# EAGLE design power_ver3 (EAGLE 9.6.2)
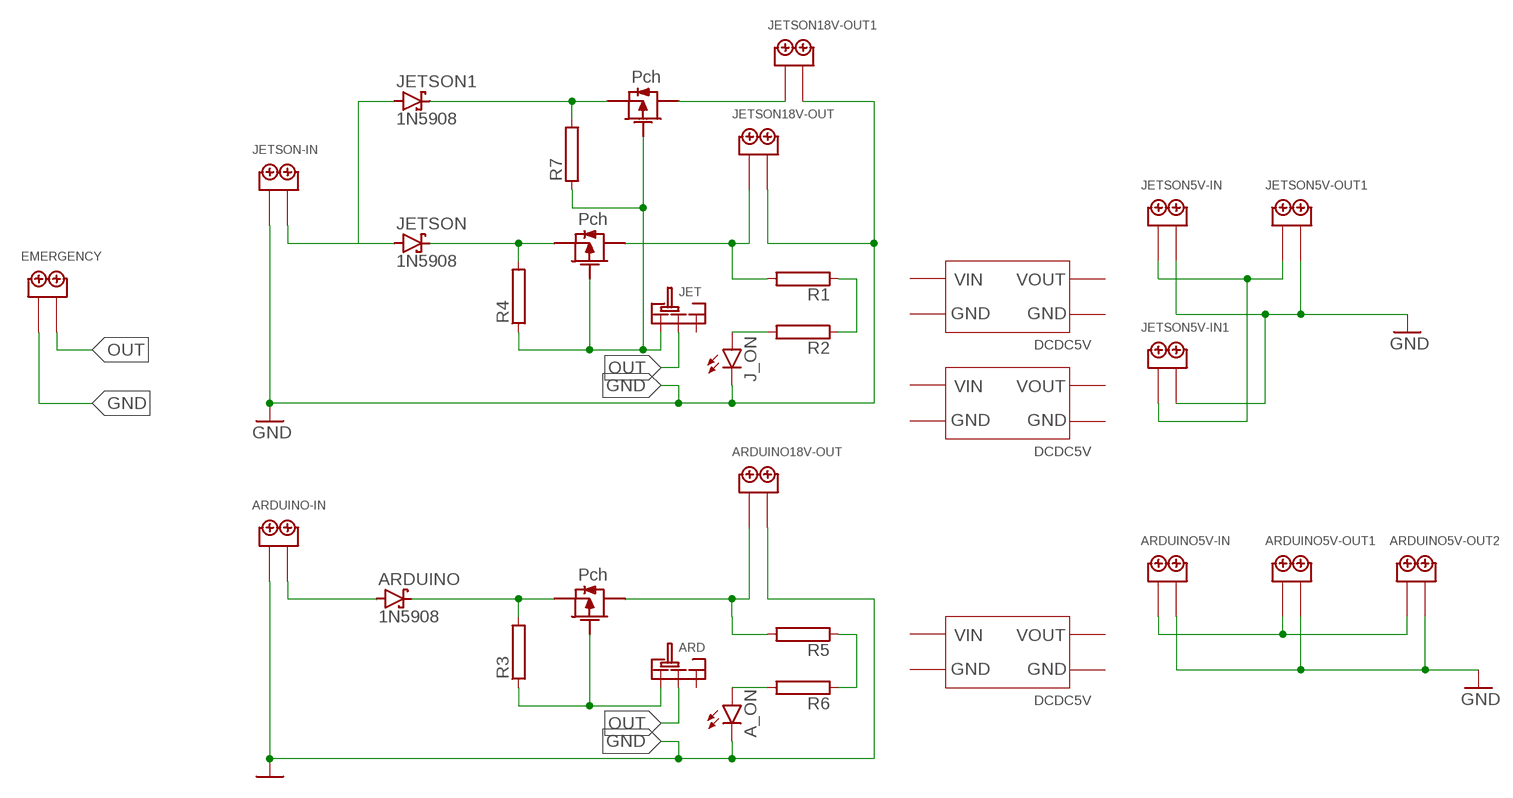
[diagram p0: schematic, sheet 1]

## Parts
A_ON  LED5MM  [LED5MM]
ARD  SRIDE_SWITCH  [SRIDE_SWITCH]
ARDUINO  1N5908  [C4111-15]
ARDUINO5V-IN  2PIN  [2PIN]
ARDUINO5V-OUT1  2PIN  [2PIN]
ARDUINO5V-OUT2  2PIN  [2PIN]
ARDUINO18V-OUT  2PIN  [2PIN]
ARDUINO-IN  2PIN  [2PIN]
EMERGENCY  2PIN  [2PIN]
J_ON  LED5MM  [LED5MM]
JET  SRIDE_SWITCH  [SRIDE_SWITCH]
JETSON  1N5908  [C4111-15]
JETSON1  1N5908  [C4111-15]
JETSON5V-IN  2PIN  [2PIN]
JETSON5V-IN1  2PIN  [2PIN]
JETSON5V-OUT1  2PIN  [2PIN]
JETSON18V-OUT  2PIN  [2PIN]
JETSON18V-OUT1  2PIN  [2PIN]
JETSON-IN  2PIN  [2PIN]
R1  RAC01  [AC01]
R2  RAC01  [AC01]
R3  RAC01  [AC01]
R4  RAC01  [AC01]
R5  RAC01  [AC01]
R6  RAC01  [AC01]
R7  RAC01  [AC01]
U$1  2SJ334  [2SJ334]
U$2  DCDCDEV  [DCDCDEV]
U$4  2SJ334  [2SJ334]
U$5  2SJ334  [2SJ334]
U$6  DCDCDEV  [DCDCDEV]
U$23  DCDCDEV  [DCDCDEV]

## Nets
18V [power]: JETSON1.A JETSON-IN.P$2 JETSON.A
GND: A_ON.K(C) ARDUINO5V-IN.P$2 ARDUINO5V-OUT1.P$2 ARDUINO5V-OUT2.P$2 ARDUINO18V-OUT.P$2 ARDUINO-IN.P$1 EMERGENCY.P$1 J_ON.K(C) JETSON5V-IN1.P$2 JETSON5V-IN.P$2 JETSON5V-OUT1.P$2 JETSON18V-OUT1.P$2 JETSON18V-OUT.P$2 JETSON-IN.P$1
MA [power]: JETSON.C R4.2 U$4.SOURCE
MA1 [power]: JETSON1.C R7.2 U$1.SOURCE
MAC [power]: JETSON18V-OUT.P$1 R1.2 U$4.DRAIN
MAD [jet]: JETSON5V-IN1.P$1 JETSON5V-IN.P$1 JETSON5V-OUT1.P$1
MBB [power]: ARDUINO-IN.P$2 ARDUINO.A
MKK [power]: ARDUINO.C R3.2 U$5.SOURCE
ML [power]: ARDUINO5V-IN.P$1 ARDUINO5V-OUT1.P$1 ARDUINO5V-OUT2.P$1
MOO [power]: ARDUINO18V-OUT.P$1 R5.2 U$5.DRAIN
N$1: ARD.L R3.1 U$5.GATE
N$2: J_ON.A R2.2
N$3: A_ON.A R6.2
N$4 [power]: JET.L R4.1 R7.1 U$1.GATE U$4.GATE
N$5 [power]: JETSON18V-OUT1.P$1 U$1.DRAIN
N$6: R5.1 R6.1
N$49: R1.1 R2.1
OUT: ARD.LR EMERGENCY.P$2 JET.LR
Unconnected: ARD.R JET.R

## Library data of the parts
A_ON J_ON = led:LED: LED OSRAM: - CHIPLED LG R971, LG N971, LY N971, LG Q971, LY Q971, LO R971, LY R971 LH N974, LH R974 LS Q976, LO Q976, LY Q976 LO Q996 - Hyper CHIPLED LW Q18S LB Q993, LB Q99A, LB R99A - SideLED LS A670, LO A670, LY A670, LG A670, LP A670 LB A673, LV A673, LT A673, LW A673 LH A674 LY A675 LS A676, LA A676, LO A676, LY A676, LW A676 LS A679, LY A679, LG A679 - Hyper Micro SIDELED® LS Y876, LA Y876, LO Y876, LY Y876 LT Y87S - SmartLED LW L88C, LW L88S LB L89C, LB L89S, LG L890 LS L89K, LO L89K, LY L89K LS L896, LA L896, LO L896, LY L896 - TOPLED LS T670, LO T670, LY T670, LG T670, LP T670 LSG T670, LSP T670, LSY T670, LOP T670, LYG T670 LG T671, LOG T671, LSG T671 LB T673, LV T673, LT T673, LW T673 LH T674 LS T676, LA T676, LO T676, LY T676, LB T676, LH T676, LSB T676, LW T676 LB T67C, LV T67C, LT T67C, LS T67K, LO T67K, LY T67K, LW E67C LS E67B, LA E67B, LO E67B, LY E67B, LB E67C, LV E67C, LT E67C LW T67C LS T679, LY T679, LG T679 LS T770, LO T770, LY T770, LG T770, LP T770 LB T773, LV T773, LT T773, LW T773 LH T774 LS E675, LA E675, LY E675, LS T675 LS T776, LA T776, LO T776, LY T776, LB T776 LHGB T686 LT T68C, LB T68C - Hyper Mini TOPLED® LB M676 - Mini TOPLED Santana® LG M470 LS M47K, LO M47K, LY M47K Source: http://www.osram.convergy.de LUXEON: - LUMILED® LXK2-PW12-R00, LXK2-PW12-S00, LXK2-PW14-U00, LXK2-PW14-V00 LXK2-PM12-R00, LXK2-PM12-S00, LXK2-PM14-U00 LXK2-PE12-Q00, LXK2-PE12-R00, LXK2-PE12-S00, LXK2-PE14-T00, LXK2-PE14-U00 LXK2-PB12-K00, LXK2-PB12-L00, LXK2-PB12-M00, LXK2-PB14-N00, LXK2-PB14-P00, LXK2-PB14-Q00 LXK2-PR12-L00, LXK2-PR12-M00, LXK2-PR14-Q00, LXK2-PR14-R00 LXK2-PD12-Q00, LXK2-PD12-R00, LXK2-PD12-S00 LXK2-PH12-R00, LXK2-PH12-S00 LXK2-PL12-P00, LXK2-PL12-Q00, LXK2-PL12-R00 Source: www.luxeon.com KINGBRIGHT: KA-3528ASYC Source: www.kingbright.com
ARD JET = Sride Switch:SRIDE_SWITCH
ARDUINO JETSON JETSON1 = diode:1N5908: DIODE schottky
ARDUINO5V-IN ARDUINO5V-OUT1 ARDUINO5V-OUT2 ARDUINO18V-OUT ARDUINO-IN EMERGENCY JETSON5V-IN JETSON5V-IN1 JETSON5V-OUT1 JETSON18V-OUT JETSON18V-OUT1 JETSON-IN = TB113-2B-x-x-0-x-x:2PIN
R1-R7 = resistor-power:R: Power Resitor; OC_FARNELL: unknown; OC_NEWARK: unknown
U$1 U$4 U$5 = 2SJ334:2SJ334
U$2 U$6 U$23 = dcdcDEVkit:DCDCDEV

## Net classes
0 default: width 1.016 mm
1 power: width 2.54 mm, clearance 0.127 mm
3 jet: width 3.81 mm, clearance 0.127 mm

## Board
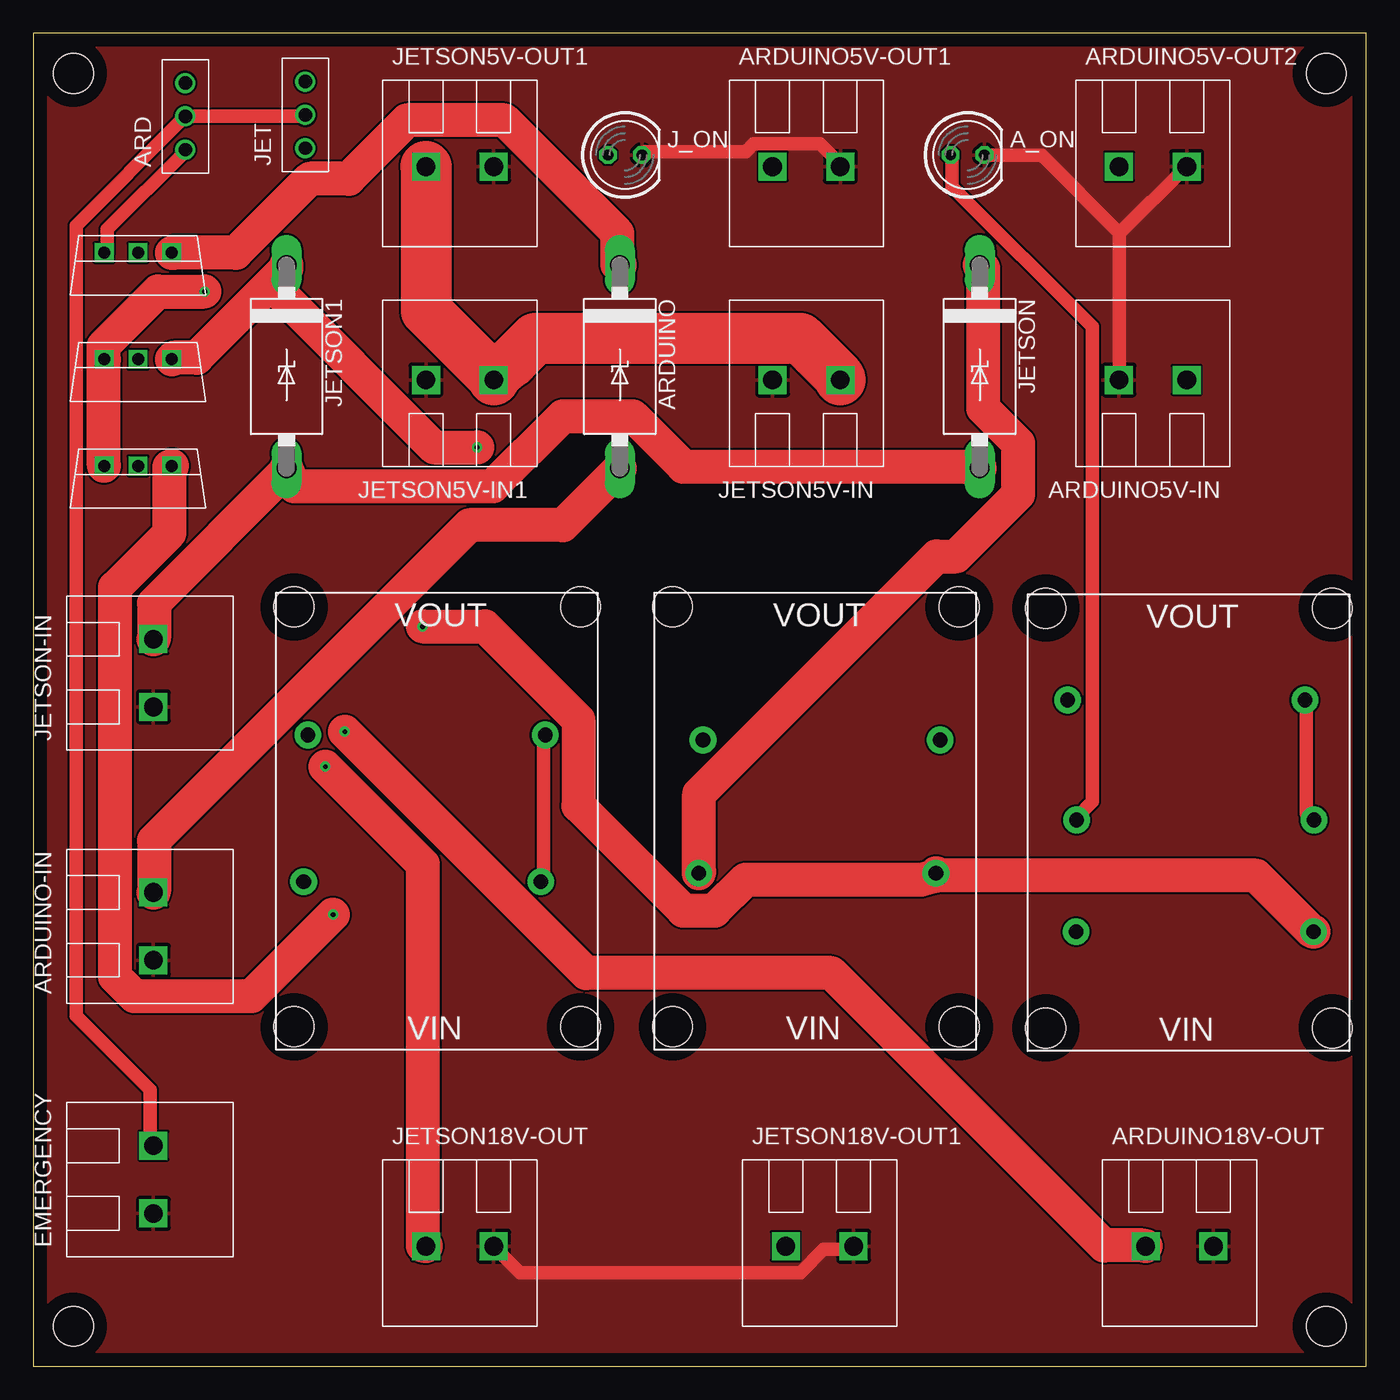
[diagram p1: board, top side]
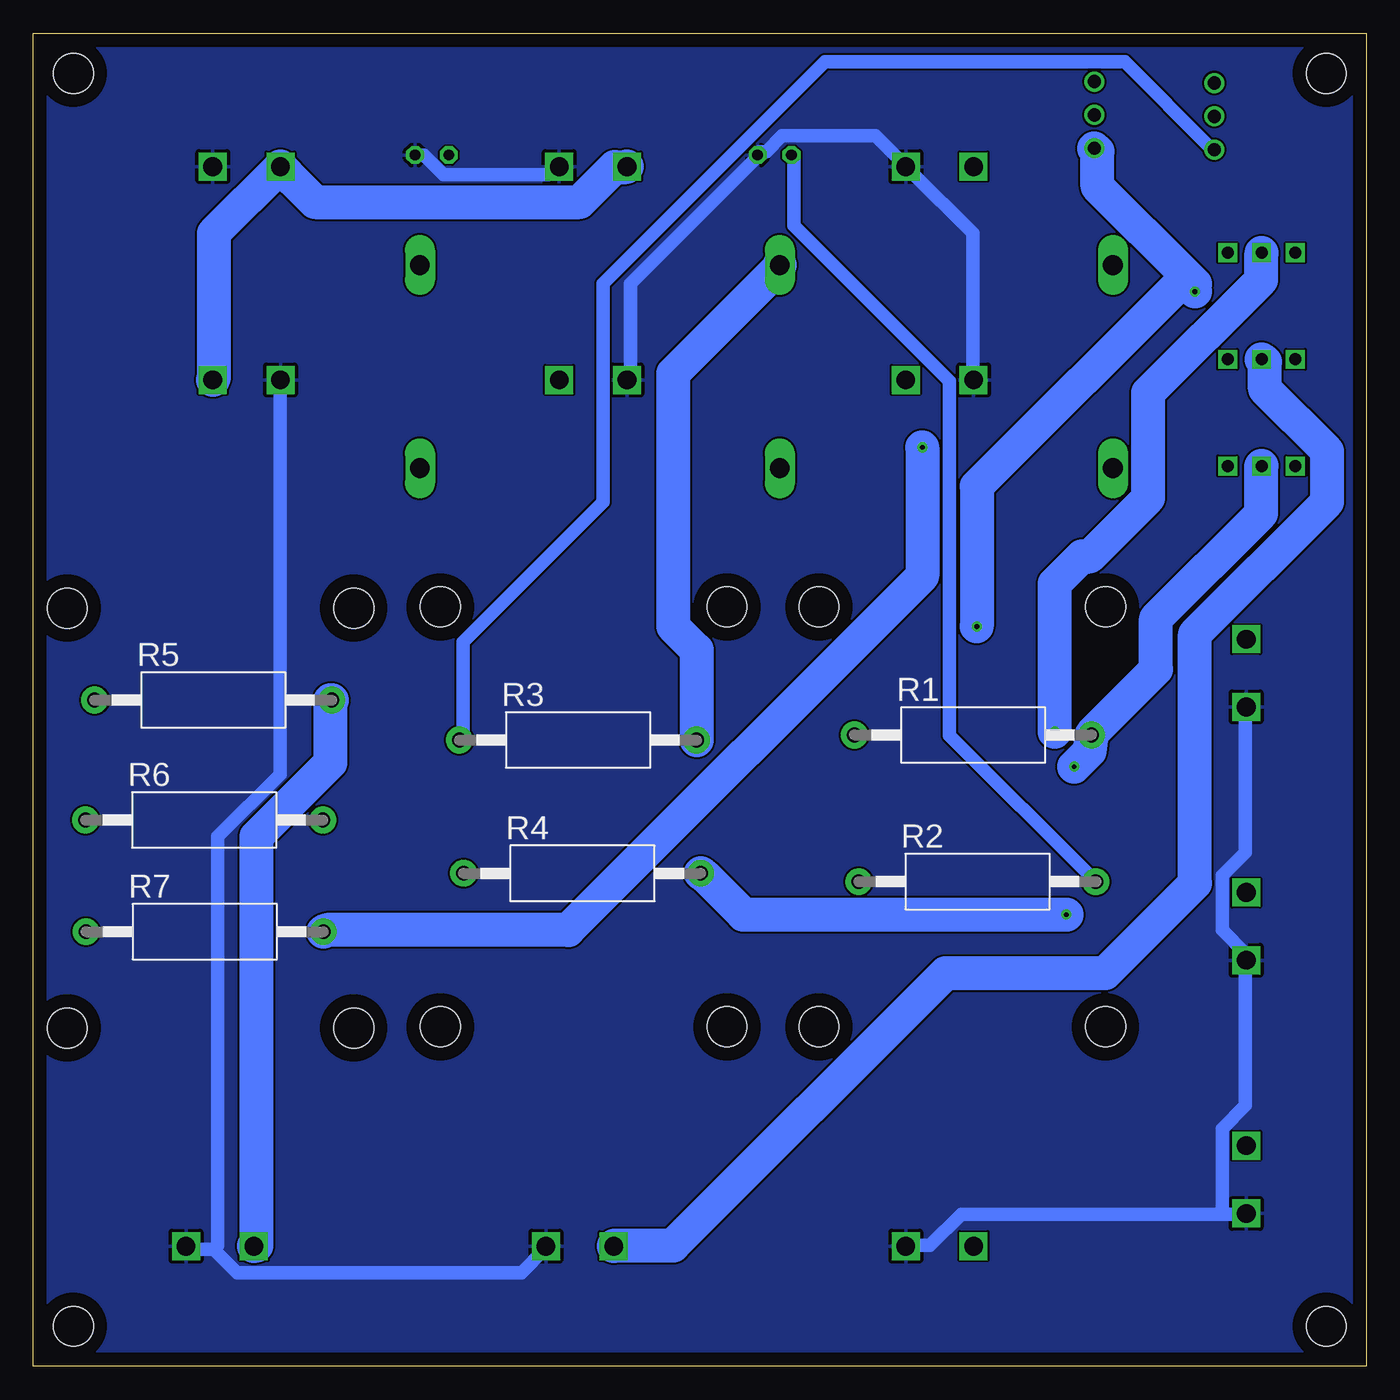
[diagram p2: board, bottom side, seen from below]

Size 100 x 100 mm. Coordinates in mm from the lower left corner, seen from the top.
Outline: 0,0 100,0 100,100 0,100 0,0
Copper layers (1*16): Top 0.035mm / dielectric 1.5mm / Bottom 0.035mm
Design rules "default": minimum track width 6mil, minimum drill 0.35mm, track to track 6mil, track to pad 6mil, pad to pad 6mil, via to via 6mil, smd to smd 6mil, copper to edge 40mil, drill to drill 6mil, minimum pad ring 10mil, minimum via ring 8mil, stop-mask expansion 4mil, vias tented up to drill 0mil, thermal gap 10mil
Holes 3 mm at 3,97 97,97 97,3 3,3

### Footprints (pad centres in the part's own frame; a part is rotated, then mirrored left to right if it is on the bottom)
LED5MM = drill 0.813 octagon: A -1.27,0; K 1.27,0
SRIDE_SWITCH = drill 1: L -2.5,0; LR 0,0; R 2.5,0
C4111-15 = drill 1.499 long: A 7.62,0; C -7.62,0
2PIN = drill 1.4 square: P$1 -2.54,0; P$2 2.54,0
AC01 = drill 1.1 pad 2: 1 -8.9,0; 2 8.9,0
2SJ334 = drill 0.9 square: DRAIN 6.35,2.54; GATE 3.81,2.54; SOURCE 8.89,2.54
DCDCDEV = hole 3: 3,0; 3,21.5; 34.5,21.5; 34.5,0

### Placement (x,y rotation side)
A_ON  70.09,90.87 0 top
ARD  11.4,93.77 90 top
ARDUINO  44,75 270 top
ARDUINO5V-IN  84,74 180 top
ARDUINO5V-OUT1  58,90 0 top
ARDUINO5V-OUT2  84,90 0 top
ARDUINO18V-OUT  86,9 0 top
ARDUINO-IN  9,33 90 top
EMERGENCY  9,14 90 top
J_ON  44.39,90.87 0 top
JET  20.4,93.88 90 top
JETSON  71,75 270 top
JETSON1  19,75 270 top
JETSON5V-IN  58,74 180 top
JETSON5V-IN1  32,74 180 top
JETSON5V-OUT1  32,90 0 top
JETSON18V-OUT  32,9 0 top
JETSON18V-OUT1  59,9 0 top
JETSON-IN  9,52 90 top
R1  29.5,47.36 0 bottom
R2  29.18,36.36 0 bottom
R3  59.14,46.98 0 bottom
R4  58.82,36.98 0 bottom
R5  86.5,49.98 0 bottom
R6  87.18,40.98 0 bottom
R7  87.14,32.6 0 bottom
U$1  1.5,73 0 top
U$2  69.46,22.47 90 top
U$4  1.5,65 0 top
U$5  1.5,81 0 top
U$6  97.46,22.37 90 top
U$23  41.06,22.47 90 top

### Tracks (layer width: path | path; a pad name or v marks a point on that pad's centre or on a via)
18V
  Top 2.54: JETSON-IN.P$2 9.05,54.62 9.05,57.25 18.99,67.18 JETSON1.A 19.57,66.02 34.47,66.02 39.73,71.27 44.98,71.27 48.78,67.47 70.98,67.47 JETSON.A
GND
  Top 1.016: 81.5,85 81.5,74.19 ARDUINO5V-IN.P$2 | 81.5,85 86.46,89.97 ARDUINO5V-OUT2.P$2 | 81.5,85 75.65,90.84 71.56,90.84 A_ON.K | J_ON.K 45.86,91.14 53.45,91.14 54.04,91.72 59,91.72 60.47,90.26 ARDUINO5V-OUT1.P$2 | JETSON18V-OUT1.P$2 61.34,8.76 59.3,8.76 57.54,7.01 36.51,7.01 34.76,8.76 JETSON18V-OUT.P$2
  Bottom 1.016: JETSON5V-IN1.P$2 29.5,74.19 29.5,85 34.18,89.67 JETSON5V-OUT1.P$2 34.76,90.26 36.8,92.3 43.81,92.3 44.98,91.14 45.57,91.14 J_ON.K 45.86,90.55 55.21,81.2 55.21,74.19 JETSON5V-IN.P$2 | A_ON.K 71.27,90.84 70.69,90.84 69.23,89.38 61.34,89.38 60.76,89.97 ARDUINO5V-OUT1.P$2 | 10.81,11.39 9.05,11.39 EMERGENCY.P$1 | 10.81,11.39 30.38,11.39 32.72,9.05 34.47,9.05 JETSON18V-OUT.P$2 | 86.46,8.76 88.51,8.76 ARDUINO18V-OUT.P$2 | 86.46,8.76 84.71,7.01 63.39,7.01 61.63,8.76 JETSON18V-OUT1.P$2 | 10.81,11.39 10.81,17.82 9.05,19.57 9.05,30.38 ARDUINO-IN.P$1 9.05,30.96 10.81,32.72 10.81,36.8 9.05,38.56 9.05,49.37 JETSON-IN.P$1 | ARDUINO5V-IN.P$2 81.5,73.9 81.5,44.4 86.17,39.73 86.17,9.05 86.46,8.76
  pour Bottom: -7,103 99,103 103,99 103,1 98,-4 1,-4 -4,1 -7,4
  pour Top: -11,106 100,106 107,99 107,1 98,-8 3,-8 -11,6
MA  (via drill 0.35)
  Top 2.54: v22.49,33.88 16.36,27.75 7.59,27.75 6.13,29.21 6.13,58.42 10.22,62.51 10.22,67.47 U$4.SOURCE | JETSON.C 71.27,82.37 71.27,71.86 73.9,69.23 73.9,65.43 69.23,60.76 67.77,60.76 49.95,42.94 49.95,37.1 R4.2
  Bottom 2.54: v22.49,33.88 46.74,33.88 49.66,36.8 R4.2
MA1  (via drill 0.35)
  Top 2.54: 17.82,81.2 18.99,82.37 JETSON1.C | 17.82,81.2 12.27,75.65 10.52,75.65 U$1.SOURCE | v33.3,68.94 30.09,68.94 17.82,81.2
  Bottom 2.54: v33.3,68.94 33.3,59.3 59.88,32.72 77.99,32.72 R7.2
MAC  (via drill 0.35)
  Top 2.54: v21.91,44.98 29.21,37.68 29.21,9.05 JETSON18V-OUT.P$1
  Bottom 2.54: U$4.DRAIN 7.89,67.47 7.89,63.97 15.77,56.08 15.77,52.29 20.45,47.61 R1.2 20.74,46.15 v21.91,44.98
MAD
  Top 3.81: 34.47,74.19 29.5,79.16 29.5,89.97 JETSON5V-OUT1.P$1 | 34.47,74.19 JETSON5V-IN1.P$1 | JETSON5V-IN.P$1 60.47,74.19 57.54,77.11 37.68,77.11 35.93,75.36 34.47,74.19
MBB
  Top 2.54: ARDUINO-IN.P$2 9.05,35.64 9.05,39.43 32.72,63.09 39.73,63.09 43.81,67.18 ARDUINO.A
MKK
  Top 2.54: U$5.SOURCE 10.52,83.54 15.19,83.54 20.74,89.09 23.66,89.09 28.04,93.47 35.34,93.47 43.81,85 43.81,82.66 ARDUINO.C
  Bottom 2.54: R3.2 50.24,47.03 50.24,53.75 51.99,55.5 51.99,74.49 44.11,82.37 ARDUINO.C
ML
  Bottom 2.54: ARDUINO5V-IN.P$1 86.46,74.19 86.46,85 81.5,89.97 ARDUINO5V-OUT2.P$1 80.62,89.09 78.87,87.34 59,87.34 56.38,89.97 55.5,89.97 ARDUINO5V-OUT1.P$1
MOO  (via drill 0.35)
  Top 2.54: v23.37,47.61 41.48,29.5 59.88,29.5 80.33,9.05 83.25,9.05 ARDUINO18V-OUT.P$1
  Bottom 2.54: v23.37,47.61 23.37,58.71 21.32,60.76 20.74,60.76 16.36,65.14 16.36,73.03 7.89,81.5 7.89,83.25 U$5.DRAIN | R5.2 77.7,49.95 77.7,45.28 83.25,39.73 83.25,9.05 ARDUINO18V-OUT.P$1
N$1
  Top 1.016: U$5.GATE 5.55,83.54 5.55,85.29 11.39,91.14 ARD.L
  Bottom 1.016: R3.1 67.77,47.03 67.77,54.33 57.25,64.85 57.25,81.2 40.6,97.85 18.11,97.85 11.68,91.43 ARD.L
N$2
  Bottom 1.016: J_ON.A 42.94,90.84 42.94,85.58 31.25,73.9 31.25,47.32 20.45,36.51 R2.2
N$3
  Top 1.016: A_ON.A 68.94,90.84 68.94,88.51 79.45,77.99 79.45,42.35 78.28,41.19 R6.2
N$4  (via drill 0.35)
  Top 2.54: 67.77,36.8 91.72,36.8 95.81,32.72 R7.1 | 67.77,36.8 R4.1 | 5.26,75.36 5.26,67.77 U$4.GATE | 5.26,75.36 U$1.GATE | v12.85,80.62 9.35,80.62 5.26,76.53 5.26,75.36 | v29.21,55.5 33.88,55.5 40.89,48.49 40.89,42.06 48.78,34.18 51.12,34.18 53.45,36.51 66.6,36.51 67.77,36.8
  Bottom 2.54: 13.44,81.79 12.85,81.2 v12.85,80.62 | 13.44,81.79 20.16,88.51 20.16,91.14 JET.L | v29.21,55.5 29.21,66.02 13.44,81.79
N$5
  Bottom 2.54: U$1.DRAIN 7.59,75.36 7.59,73.32 2.92,68.64 2.92,64.85 12.85,54.91 12.85,36.22 19.57,29.5 31.55,29.5 51.99,9.05 56.38,9.05 JETSON18V-OUT1.P$1
N$6
  Top 1.016: R5.1 95.52,49.95 95.52,41.48 95.81,41.19 R6.1
N$49
  Top 1.016: R2.1 38.27,36.51 38.27,47.32 R1.1
OUT
  Top 1.016: JET.LR 20.16,93.76 11.68,93.76 ARD.LR 11.1,93.47 3.21,85.58 3.21,26.29 8.76,20.74 8.76,16.65 EMERGENCY.P$2